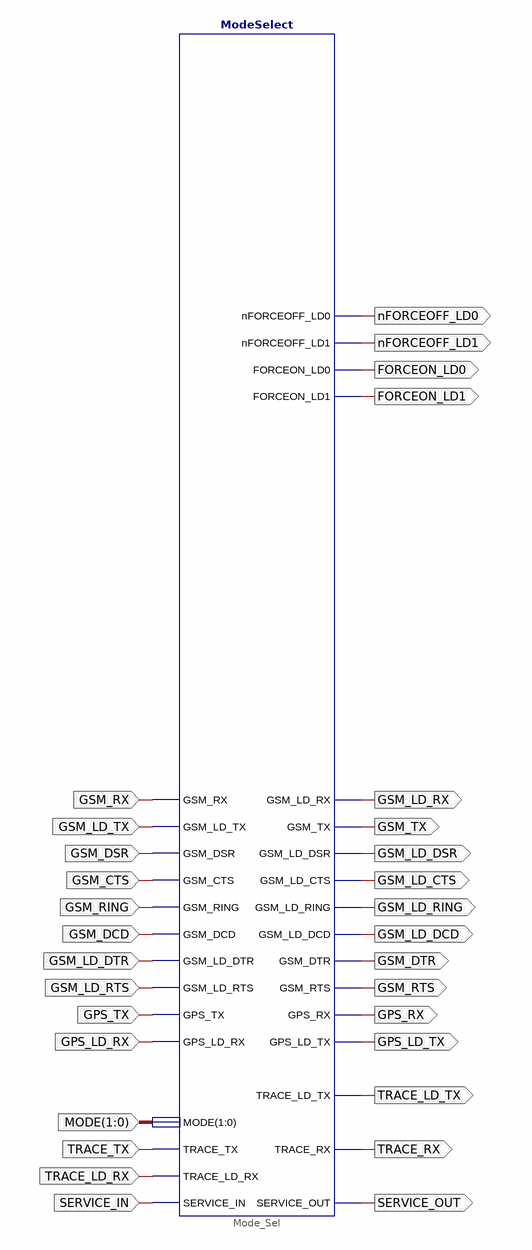
[diagram p0: schematic sheet 1]
// Xilinx ISE schematic ModeSelect_sch.sch (xbr) as structural Verilog: 1 symbols, 31 ports
module ModeSelect_sch (
  input  GSM_RX,
  input  GSM_LD_TX,
  input  GSM_DSR,
  input  GSM_CTS,
  input  GSM_RING,
  input  GSM_DCD,
  input  GSM_LD_DTR,
  input  GSM_LD_RTS,
  input  GPS_TX,
  input  GPS_LD_RX,
  input  [1:0] MODE,
  input  TRACE_TX,
  input  TRACE_LD_RX,
  input  SERVICE_IN,
  output SERVICE_OUT,
  output TRACE_RX,
  output TRACE_LD_TX,
  output GPS_LD_TX,
  output GPS_RX,
  output GSM_RTS,
  output GSM_DTR,
  output GSM_LD_DCD,
  output GSM_LD_RING,
  output GSM_LD_CTS,
  output GSM_LD_DSR,
  output GSM_TX,
  output GSM_LD_RX,
  output FORCEON_LD1,
  output FORCEON_LD0,
  output nFORCEOFF_LD1,
  output nFORCEOFF_LD0
);

  ModeSelect Mode_Sel (
    .GSM_RX(GSM_RX), .GSM_LD_TX(GSM_LD_TX), .GSM_DSR(GSM_DSR), .GSM_CTS(GSM_CTS), .GSM_RING(GSM_RING),
    .GSM_DCD(GSM_DCD), .GSM_LD_DTR(GSM_LD_DTR), .GSM_LD_RTS(GSM_LD_RTS), .GPS_TX(GPS_TX),
    .GPS_LD_RX(GPS_LD_RX), .TRACE_TX(TRACE_TX), .TRACE_LD_RX(TRACE_LD_RX), .MODE(MODE),
    .GSM_LD_RX(GSM_LD_RX), .GSM_TX(GSM_TX), .GSM_LD_DSR(GSM_LD_DSR), .GSM_LD_CTS(GSM_LD_CTS),
    .GSM_LD_RING(GSM_LD_RING), .GSM_LD_DCD(GSM_LD_DCD), .GSM_DTR(GSM_DTR), .GSM_RTS(GSM_RTS),
    .GPS_RX(GPS_RX), .GPS_LD_TX(GPS_LD_TX), .TRACE_RX(TRACE_RX), .TRACE_LD_TX(TRACE_LD_TX),
    .nFORCEOFF_LD0(nFORCEOFF_LD0), .nFORCEOFF_LD1(nFORCEOFF_LD1), .FORCEON_LD0(FORCEON_LD0),
    .FORCEON_LD1(FORCEON_LD1), .SERVICE_IN(SERVICE_IN), .SERVICE_OUT(SERVICE_OUT));
endmodule
